# Altium schematic sheet CLKB_uplink_phy.SchDoc
size A3
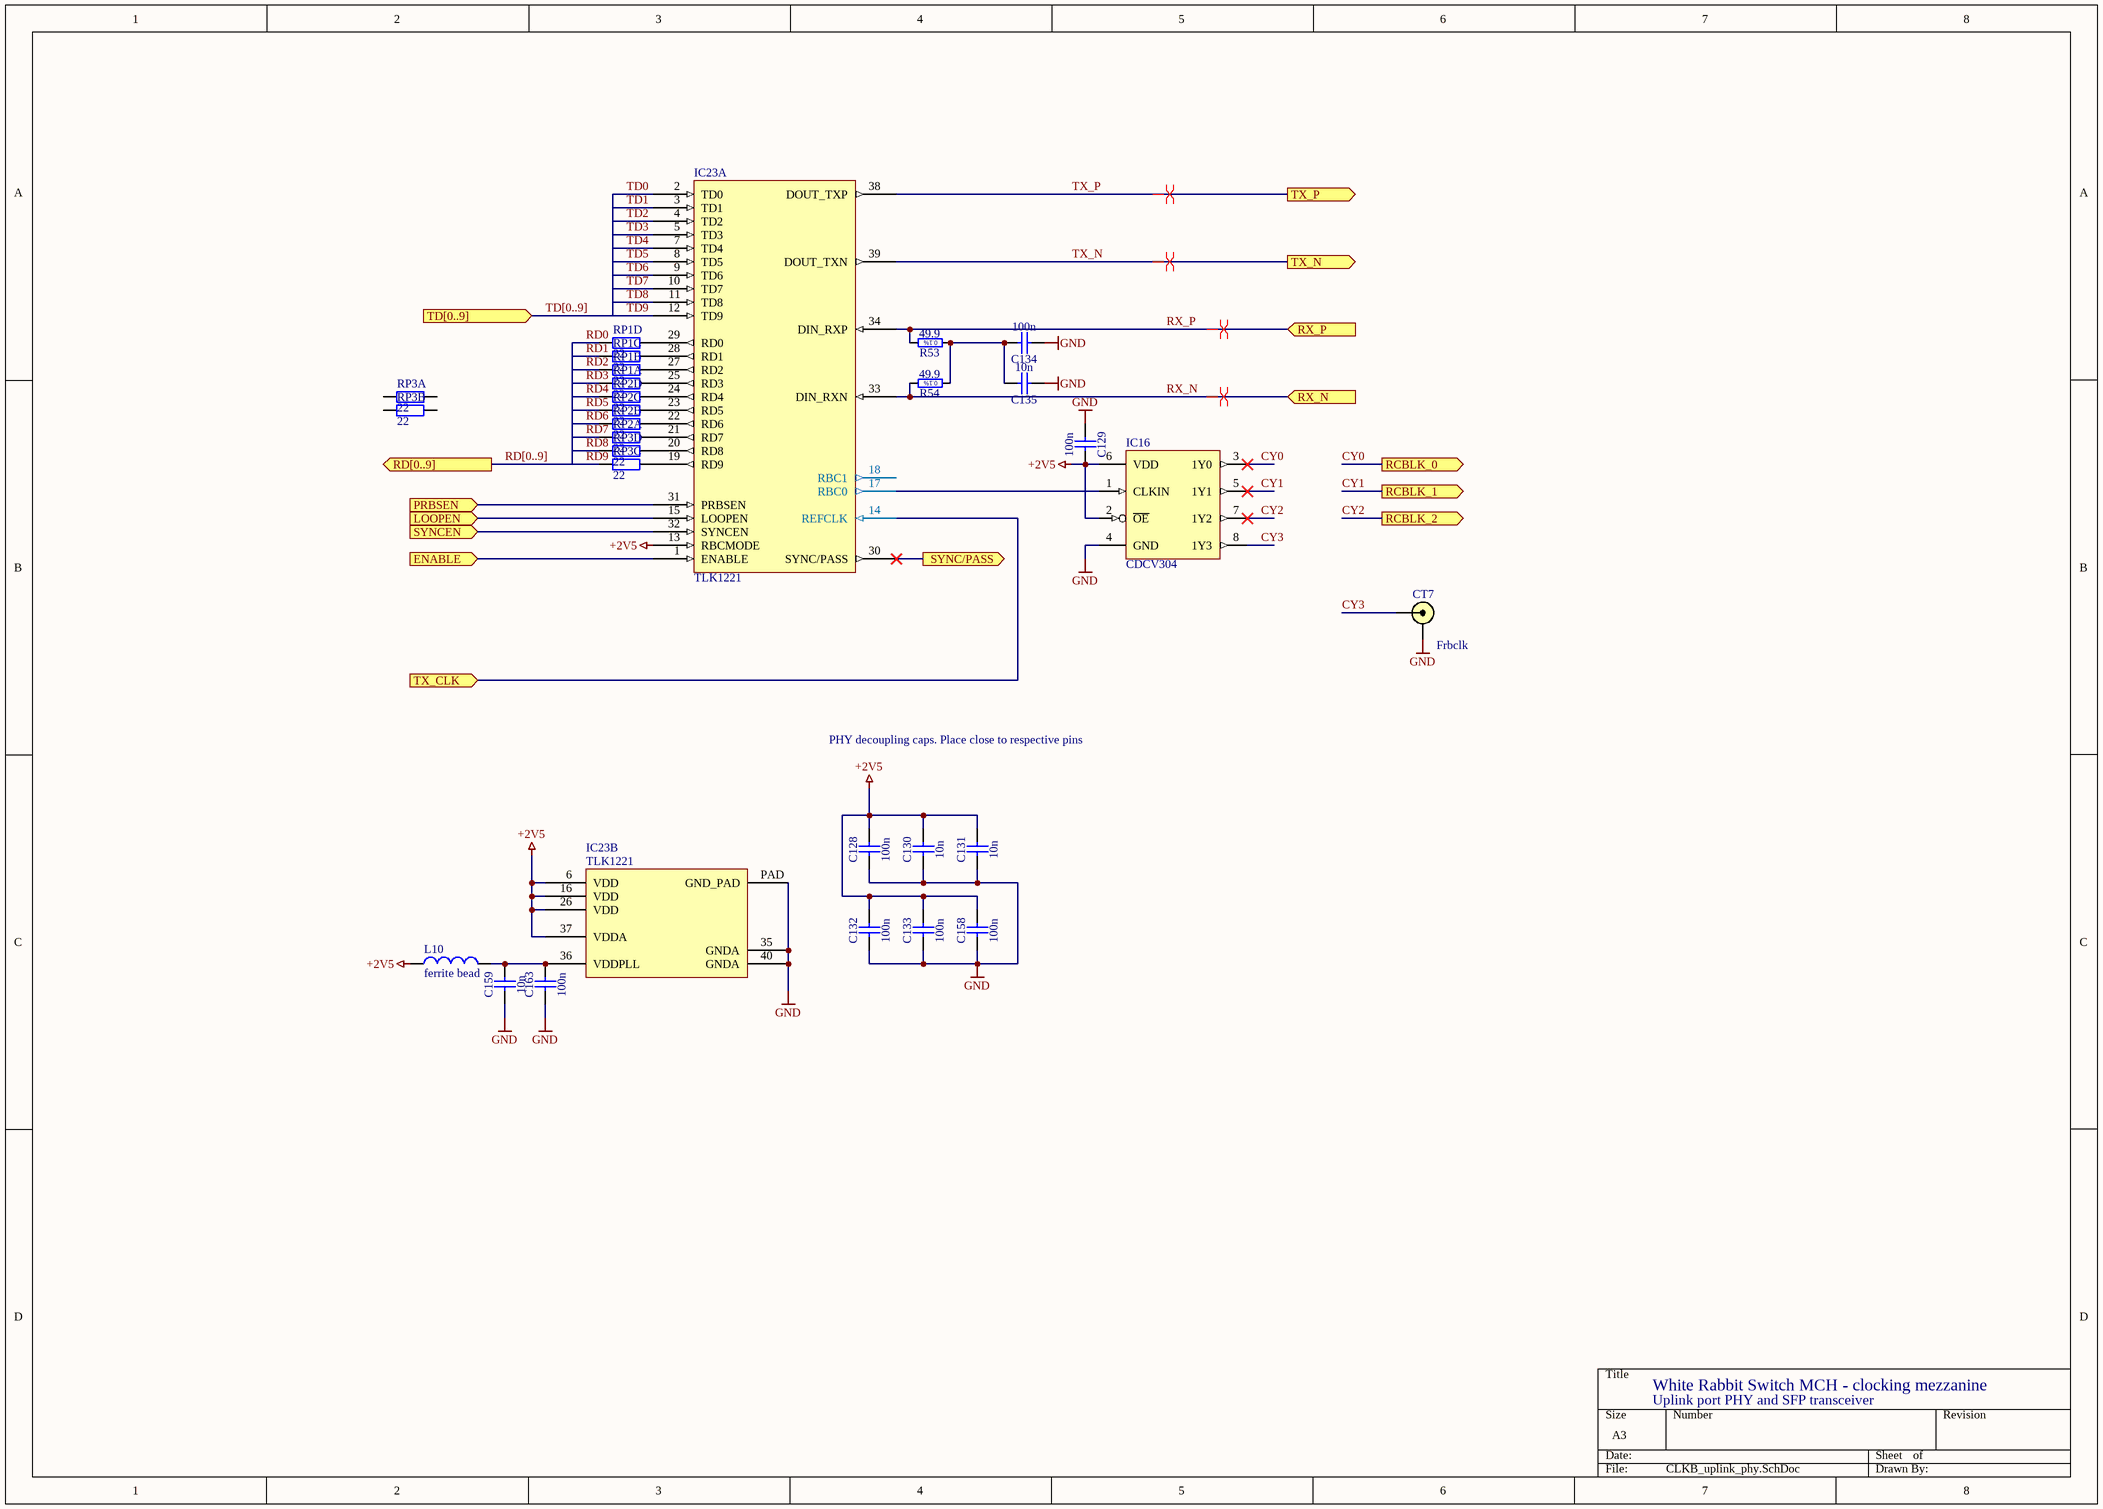
[diagram p0: CLKB_uplink_phy.SchDoc]

## Parts
C128  100n  [CAPC1005X55N]
C129  100n  [CAPC1608X87N]
C130  10n  [CAPC1005X55N]
C131  10n  [CAPC1005X55N]
C132  100n  [CAPC1005X55N]
C133  100n  [CAPC1005X55N]
C134  100n  [CAPC1608X87N]
C135  10n  [CAPC1608X87N]
C158  100n  [CAPC1005X55N]
C159  10n  [CAPC1005X55N]
C163  100n  [CAPC1005X55N]
CT7  Frbclk  [CON_UFL_HIROSE_RECEPTACLE]
IC16  CDCV304  [TSOP65P490-8AN]
IC23  TLK1221  [QFN40_powerpad]  (parts A,B of 2)
L10  value ferrite bead  [INDC1608-0603]  (hidden comment: Inductor)
R53  49.9  [RESC1608X55N]
R54  49.9  [RESC1608X55N]
RP1  value 22  [YC124]  (hidden comment: 22 0804)  (parts A,B,C,D of 4)
RP2  value 22  [YC124]  (hidden comment: 22 0804)  (parts A,B,C,D of 4)
RP3  value 22  [YC124]  (hidden comment: 22 0804)  (parts A,B,C,D of 4)

## Ports
ENABLE (in), LOOPEN (in), PRBSEN (in), RCBLK_0 (out), RCBLK_1 (out), RCBLK_2 (out), RD[0..9] (out), RX_N (in), RX_P (in), SYNC/PASS (out), SYNCEN (in), TD[0..9] (in), TX_CLK (in), TX_N (out), TX_P (out)

## Nets
+2V5: C128.2 C129.2 C130.2 C131.2 C132.2 C133.2 C158.2 IC16.2(~{OE}) IC16.6(VDD) IC23.6(VDD) IC23.13(RBCMODE) IC23.16(VDD) IC23.26(VDD) IC23.37(VDDA) L10.2
GND: C128.1 C129.1 C130.1 C131.1 C132.1 C133.1 C134.1 C135.1 C158.1 C159.1 C163.1 CT7.2 IC16.4(GND) IC23.35(GNDA) IC23.40(GNDA) IC23.PAD(GND_PAD)
CY0: IC16.3(1Y0) ; port RCBLK_0
CY1: IC16.5(1Y1) ; port RCBLK_1
CY2: IC16.7(1Y2) ; port RCBLK_2
CY3: CT7.1 IC16.8(1Y3)
ENABLE: IC23.1(ENABLE) ; port ENABLE
LOOPEN: IC23.15(LOOPEN) ; port LOOPEN
PRBSEN: IC23.31(PRBSEN) ; port PRBSEN
RD0: RP1.4(A)
RD1: RP1.3(A)
RD2: RP1.2(A)
RD3: RP1.1(A)
RD4: RP2.4(A)
RD5: RP2.3(A)
RD6: RP2.2(A)
RD7: RP2.1(A)
RD8: RP3.4(A)
RD9: RP3.3(A)
RX_N: IC23.33(DIN_RXN) R54.2 ; port RX_N
RX_P: IC23.34(DIN_RXP) R53.2 ; port RX_P
SYNC/PASS: IC23.30(SYNC/PASS) ; port SYNC/PASS
SYNCEN: IC23.32(SYNCEN) ; port SYNCEN
TD0: IC23.2(TD0)
TD1: IC23.3(TD1)
TD2: IC23.4(TD2)
TD3: IC23.5(TD3)
TD4: IC23.7(TD4)
TD5: IC23.8(TD5)
TD6: IC23.9(TD6)
TD7: IC23.10(TD7)
TD8: IC23.11(TD8)
TD9: IC23.12(TD9)
TX_CLK: IC23.14(REFCLK) ; port TX_CLK
TX_N: IC23.39(DOUT_TXN) ; port TX_N
TX_P: IC23.38(DOUT_TXP) ; port TX_P
NetC134_2: C134.2 C135.2 R53.1 R54.1
NetC159_2: C159.2 C163.2 IC23.36(VDDPLL) L10.1
NetIC16_1: IC16.1(CLKIN) IC23.17(RBC0)
NetIC23_19: IC23.19(RD9) RP3.6(B)
NetIC23_20: IC23.20(RD8) RP3.5(B)
NetIC23_21: IC23.21(RD7) RP2.8(B)
NetIC23_22: IC23.22(RD6) RP2.7(B)
NetIC23_23: IC23.23(RD5) RP2.6(B)
NetIC23_24: IC23.24(RD4) RP2.5(B)
NetIC23_25: IC23.25(RD3) RP1.8(B)
NetIC23_27: IC23.27(RD2) RP1.7(B)
NetIC23_28: IC23.28(RD1) RP1.6(B)
NetIC23_29: IC23.29(RD0) RP1.5(B)

Not connected (* = marked no-connect by the designer): IC23 18(RBC1); RP3 1(A) 2(A) 7(B) 8(B)

## Buses and harness runs
bus RD[0..9] = port RD[0..9]
bus TD[0..9] = port TD[0..9]

## Layout directives
differential pair: RX_N, RX_P, TX_N, TX_P

## Notes on the sheet
- PHY decoupling caps. Place close to respective pins
- White Rabbit Switch MCH - clocking mezzanine
- Uplink port PHY and SFP transceiver
- (in symbol R0603_49R9_0.1%_0.063W_10PPM) 0.1%

## Library data of the parts
C128 C132 C133 C158 C163 = CC0402_100NF_16V_10%_X7R: Non-polarised capacitor; Part Description: SMD Multilayer Chip Ceramic Capacitor; Manufacturer: GENERIC; Manufacturer1 Part Number: 223878715649; Manufacturer1 Datasheet: \\cern.ch\dfs\Applications\Altium\Datasheets\CC0402_X7R_PHYCOMP.pdf; Value: 100nF; Voltage: 16V; TC: X7R; Tolerance: ±10%; Table: Capacitors SMD; Part Number: CC0402_100NF_16V_10%_X7R; Component Kind: Standard; Component Type: Standard; Designator: Capacitor - non polarized; Library Reference: Capacitor - non polarized; Pin Count: 2; Status: Not Recommended; Manufacturer Part Number: CC0402_100NF_16V_10%_X7R; Case: 0402; Mounted: Yes; Socket: No; SMD: Yes; Manufacturer1 Example: PHYCOMP; Manufacturer1 ComponentHeight: 0.55mm; HelpURL: \\cern.ch\dfs\Applications\Altium\Datasheets\CC0402_X7R_PHYCOMP.pdf; Author: CERN DEM JLC; CreateDate: 2007-12-03; LatestRevisionDate: 2007-12-03
C129 C134 = CC0603_100NF_50V_10%_X7R: Non-polarised capacitor; Part Description: SMD Multilayer Chip Ceramic Capacitor; Manufacturer: GENERIC; Manufacturer1 Part Number: 223858615649; Manufacturer1 Datasheet: \\cern.ch\dfs\Applications\Altium\Datasheets\CC0603_X7R_PHYCOMP.pdf; Value: 100nF; Voltage: 50V; TC: X7R; Tolerance: ±10%; Table: Capacitors SMD; Part Number: CC0603_100NF_50V_10%_X7R; Component Kind: Standard; Component Type: Standard; Designator: Capacitor - non polarized; Library Reference: Capacitor - non polarized; Pin Count: 2; Status: Preferred; Manufacturer Part Number: CC0603_100NF_50V_10%_X7R; Case: 0603; Mounted: Yes; Socket: No; SMD: Yes; Manufacturer1 Example: PHYCOMP; Manufacturer1 ComponentHeight: 0.87mm; HelpURL: \\cern.ch\dfs\Applications\Altium\Datasheets\CC0603_X7R_PHYCOMP.pdf; Author: CERN DEM JLC; CreateDate: 12/3/2007; LatestRevisionDate: 12/3/2007
C130 C131 C159 = CC0402_10NF_16V_10%_X7R: Non-polarised capacitor; Part Description: SMD Multilayer Chip Ceramic Capacitor; Manufacturer: GENERIC; Manufacturer1 Part Number: 223878715636; Manufacturer1 Datasheet: \\cern.ch\dfs\Applications\Altium\Datasheets\CC0402_X7R_PHYCOMP.pdf; Value: 10nF; Voltage: 16V; TC: X7R; Tolerance: ±10%; Table: Capacitors SMD; Part Number: CC0402_10NF_16V_10%_X7R; Component Kind: Standard; Component Type: Standard; Designator: Capacitor - non polarized; Library Reference: Capacitor - non polarized; Pin Count: 2; Status: Not Recommended; Manufacturer Part Number: CC0402_10NF_16V_10%_X7R; Case: 0402; Mounted: Yes; Socket: No; SMD: Yes; Manufacturer1 Example: PHYCOMP; Manufacturer1 ComponentHeight: 0.55mm; HelpURL: \\cern.ch\dfs\Applications\Altium\Datasheets\CC0402_X7R_PHYCOMP.pdf; Author: CERN DEM JLC; CreateDate: 2007-12-03; LatestRevisionDate: 2007-12-03
C135 = CC0603_10NF_50V_10%_X7R: Non-polarised capacitor; Part Description: SMD Multilayer Chip Ceramic Capacitor; Manufacturer: GENERIC; Manufacturer1 Part Number: 223858615636; Manufacturer1 Datasheet: \\cern.ch\dfs\Applications\Altium\Datasheets\CC0603_X7R_PHYCOMP.pdf; Value: 10nF; Voltage: 50V; TC: X7R; Tolerance: ±10%; Table: Capacitors SMD; Part Number: CC0603_10NF_50V_10%_X7R; Component Kind: Standard; Component Type: Standard; Designator: Capacitor - non polarized; Library Reference: Capacitor - non polarized; Pin Count: 2; Status: Preferred; Manufacturer Part Number: CC0603_10NF_50V_10%_X7R; Case: 0603; Mounted: Yes; Socket: No; SMD: Yes; Manufacturer1 Example: PHYCOMP; Manufacturer1 ComponentHeight: 0.87mm; HelpURL: \\cern.ch\dfs\Applications\Altium\Datasheets\CC0603_X7R_PHYCOMP.pdf; Author: CERN DEM JLC; CreateDate: 12/3/2007; LatestRevisionDate: 12/3/2007
CT7 = CON_TESTPOINT_UFL: UFL connector testpoint
IC16 = CDCV304: 1:4 LVTTL fanout
IC23 = TLK1221: Texas Instruments Gigabit Ethernet PHY with deterministic clocking and LVPECL output interface; RefId: 1576976; Value: TLK1221RHAT; Supplier: Farnell
L10 = Inductor: Ferrite bead; Published: 8-Jun-2000; Revision: July-2002: Re-released for DXP Platform.; Publisher: Altium Limited
R53 R54 = R0603_49R9_0.1%_0.063W_10PPM: Resistor - 0.1%; Part Description: Thin Film Chip Resistor; Manufacturer: GENERIC; Manufacturer1 Part Number: RN73C1J49R9BTDF; Manufacturer1 Datasheet: \\cern.ch\dfs\Applications\Altium\Datasheets\R0603_Tyco_RN73.pdf; Value: 49R9; Power: 0.063W; TC: ±10ppm; Table: Resistors SMD; Part Number: R0603_49R9_0.1%_0.063W_10PPM; Component Kind: Standard; Component Type: Standard; Designator: Resistor - 0.1%; Library Reference: Resistor - 0.1%; Pin Count: 2; Status: Not recommended; Tolerance: ±0.1%; Manufacturer Part Number: R0603_49R9_0.1%_0.063W_10PPM; Case: 0603; Mounted: Yes; Socket: No; SMD: Yes; Manufacturer1 Example: TYCO HOLSWORTHY; Manufacturer1 ComponentHeight: 0.5mm; HelpURL: \\cern.ch\dfs\Applications\Altium\Datasheets\R0603_Tyco_RN73.pdf; Author: CERN DEM JLC; CreateDate: 12/3/2007; LatestRevisionDate: 3/13/2008
RP1-RP3 = Res_Pack4_22R_YC124: 4-resistor pack; RefId: AVX  CRB2A4 series; Supplier: Farnell